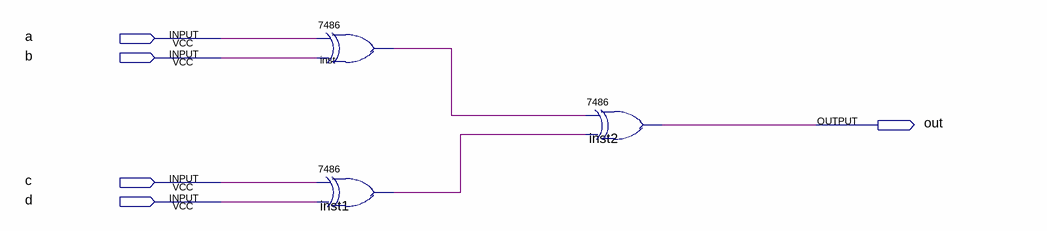
[diagram p0: schematic sheet]
// Quartus schematic 2improve.bdf as structural Verilog: 3 symbols, 5 pins
module \2improve  (
  input  a,
  input  b,
  input  c,
  input  d,
  output out
);

  wire inst1_1, inst_1;

  \7486  inst (.\2 (a), .\3 (b), .\1 (inst_1));
  \7486  inst1 (.\2 (c), .\3 (d), .\1 (inst1_1));
  \7486  inst2 (.\2 (inst_1), .\3 (inst1_1), .\1 (out));
endmodule
